# Altium schematic sheet KeyInput.SchDoc: Key Input
size A3; Author: eldar6776@hotmail.com; DrawnBy: Eldar Dedić; Organization: PROVEN d.o.o.; Address1: Adema Buće 102; Address2: 71000 Sarajevo; Address3: Federacija BiH; Address4: Bosna i Hercegovina; DocumentNumber: DE211213; Revision: 001; SheetNumber: 12; SheetTotal: 15; ProjectName: MIKSER SIROVINE
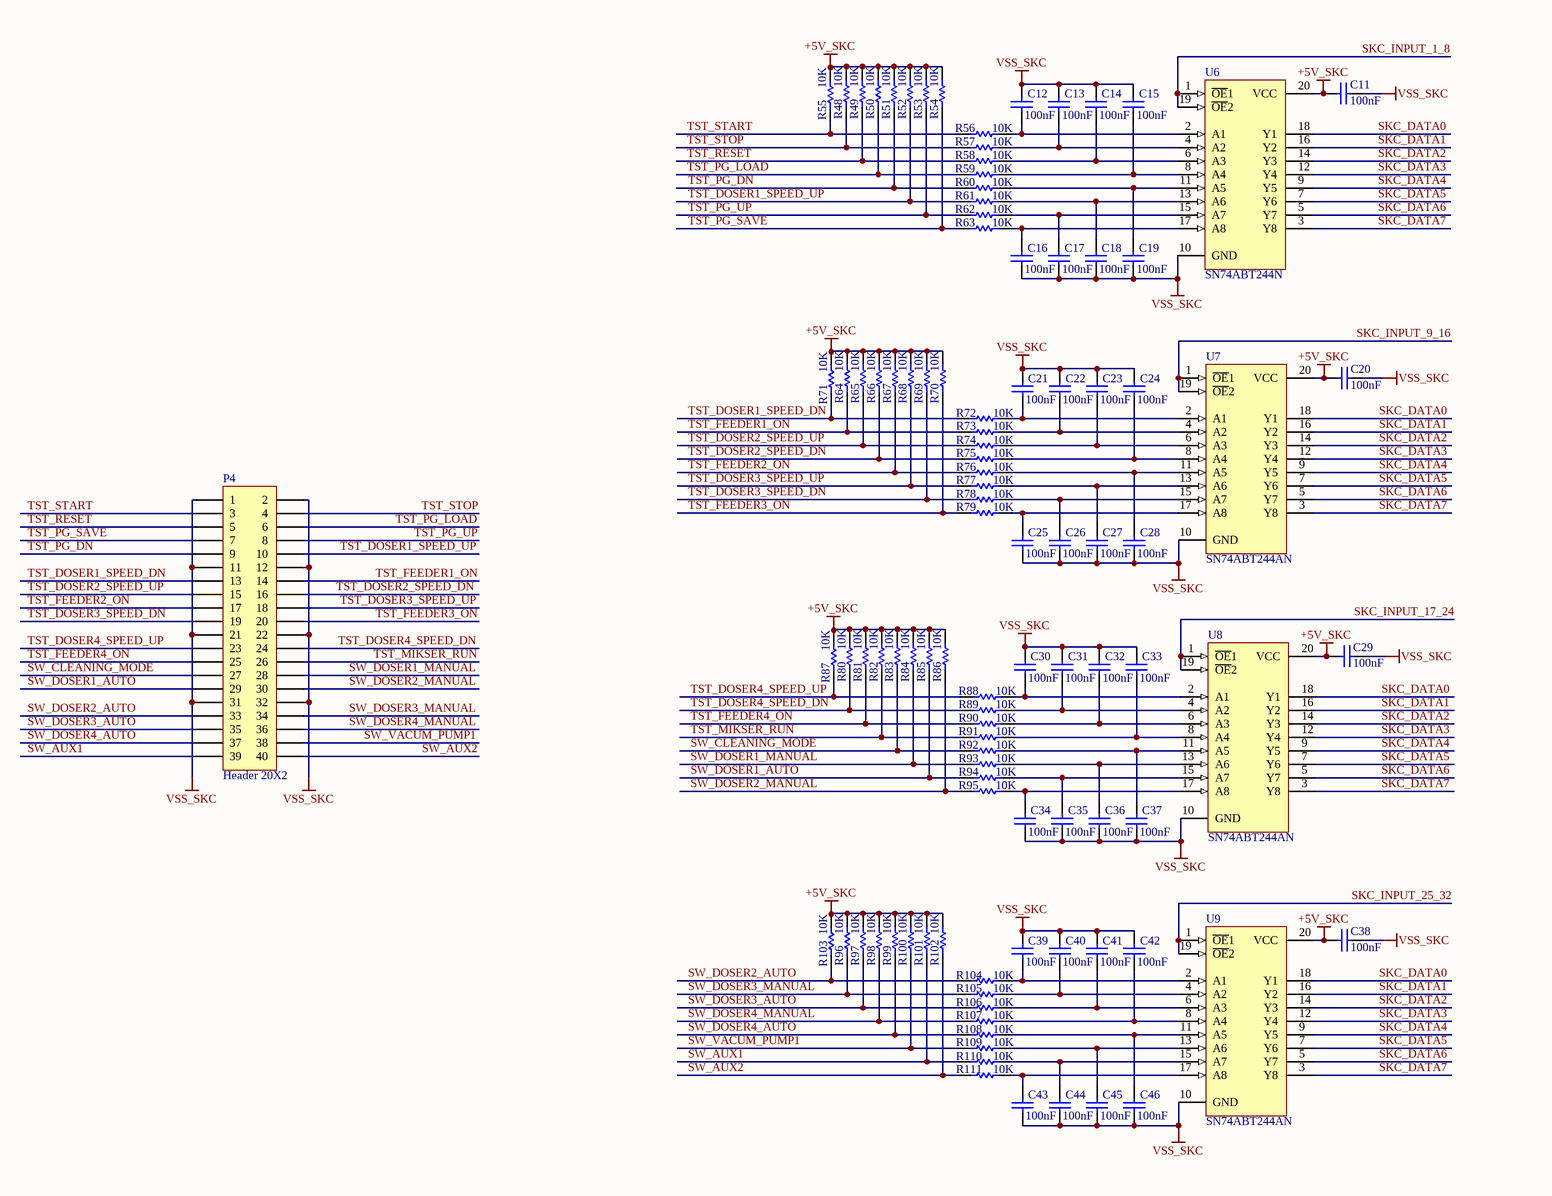
[diagram p0: KeyInput.SchDoc]

## Parts
C11  value 100nF  [1206]
C12  value 100nF  [1206]
C13  value 100nF  [1206]
C14  value 100nF  [1206]
C15  value 100nF  [1206]
C16  value 100nF  [1206]
C17  value 100nF  [1206]
C18  value 100nF  [1206]
C19  value 100nF  [1206]
C20  value 100nF  [1206]
C21  value 100nF  [1206]
C22  value 100nF  [1206]
C23  value 100nF  [1206]
C24  value 100nF  [1206]
C25  value 100nF  [1206]
C26  value 100nF  [1206]
C27  value 100nF  [1206]
C28  value 100nF  [1206]
C29  value 100nF  [1206]
C30  value 100nF  [1206]
C31  value 100nF  [1206]
C32  value 100nF  [1206]
C33  value 100nF  [1206]
C34  value 100nF  [1206]
C35  value 100nF  [1206]
C36  value 100nF  [1206]
C37  value 100nF  [1206]
C38  value 100nF  [1206]
C39  value 100nF  [1206]
C40  value 100nF  [1206]
C41  value 100nF  [1206]
C42  value 100nF  [1206]
C43  value 100nF  [1206]
C44  value 100nF  [1206]
C45  value 100nF  [1206]
C46  value 100nF  [1206]
P4  Header 20X2  [HDR2X20]
R48  10K  [ERA-0805]
R49  10K  [ERA-0805]
R50  10K  [ERA-0805]
R51  10K  [ERA-0805]
R52  10K  [ERA-0805]
R53  10K  [ERA-0805]
R54  10K  [ERA-0805]
R55  10K  [ERA-0805]
R56  10K  [ERA-0805]
R57  10K  [ERA-0805]
R58  10K  [ERA-0805]
R59  10K  [ERA-0805]
R60  10K  [ERA-0805]
R61  10K  [ERA-0805]
R62  10K  [ERA-0805]
R63  10K  [ERA-0805]
R64  10K  [ERA-0805]
R65  10K  [ERA-0805]
R66  10K  [ERA-0805]
R67  10K  [ERA-0805]
R68  10K  [ERA-0805]
R69  10K  [ERA-0805]
R70  10K  [ERA-0805]
R71  10K  [ERA-0805]
R72  10K  [ERA-0805]
R73  10K  [ERA-0805]
R74  10K  [ERA-0805]
R75  10K  [ERA-0805]
R76  10K  [ERA-0805]
R77  10K  [ERA-0805]
R78  10K  [ERA-0805]
R79  10K  [ERA-0805]
R80  10K  [ERA-0805]
R81  10K  [ERA-0805]
R82  10K  [ERA-0805]
R83  10K  [ERA-0805]
R84  10K  [ERA-0805]
R85  10K  [ERA-0805]
R86  10K  [ERA-0805]
R87  10K  [ERA-0805]
R88  10K  [ERA-0805]
R89  10K  [ERA-0805]
R90  10K  [ERA-0805]
R91  10K  [ERA-0805]
R92  10K  [ERA-0805]
R93  10K  [ERA-0805]
R94  10K  [ERA-0805]
R95  10K  [ERA-0805]
R96  10K  [ERA-0805]
R97  10K  [ERA-0805]
R98  10K  [ERA-0805]
R99  10K  [ERA-0805]
R100  10K  [ERA-0805]
R101  10K  [ERA-0805]
R102  10K  [ERA-0805]
R103  10K  [ERA-0805]
R104  10K  [ERA-0805]
R105  10K  [ERA-0805]
R106  10K  [ERA-0805]
R107  10K  [ERA-0805]
R108  10K  [ERA-0805]
R109  10K  [ERA-0805]
R110  10K  [ERA-0805]
R111  10K  [ERA-0805]
U6  SN74ABT244N  [N020]
U7  SN74ABT244AN  [N020]
U8  SN74ABT244AN  [N020]
U9  SN74ABT244AN  [N020]

## Nets
+5V_SKC: C11.1 C20.1 C29.1 C38.1 R48.2 R49.2 R50.2 R51.2 R52.2 R53.2 R54.2 R55.2 R64.2 R65.2 R66.2 R67.2 R68.2 R69.2 R70.2 R71.2 R80.2 R81.2 R82.2 R83.2 R84.2 R85.2 R86.2 R87.2 R96.2 R97.2 R98.2 R99.2 R100.2 R101.2 R102.2 R103.2 U6.20(VCC) U7.20(VCC) U8.20(VCC) U9.20(VCC)
VSS_SKC: C11.2 C12.2 C13.2 C14.2 C15.2 C16.1 C17.1 C18.1 C19.1 C20.2 C21.2 C22.2 C23.2 C24.2 C25.1 C26.1 C27.1 C28.1 C29.2 C30.2 C31.2 C32.2 C33.2 C34.1 C35.1 C36.1 C37.1 C38.2 C39.2 C40.2 C41.2 C42.2 C43.1 C44.1 C45.1 C46.1 P4.1 P4.2 P4.11 P4.12 P4.21 P4.22 P4.31 P4.32 U6.10(GND) U7.10(GND) U8.10(GND) U9.10(GND)
SKC_DATA0: U6.18(Y1) U7.18(Y1) U8.18(Y1) U9.18(Y1)
SKC_DATA1: U6.16(Y2) U7.16(Y2) U8.16(Y2) U9.16(Y2)
SKC_DATA2: U6.14(Y3) U7.14(Y3) U8.14(Y3) U9.14(Y3)
SKC_DATA3: U6.12(Y4) U7.12(Y4) U8.12(Y4) U9.12(Y4)
SKC_DATA4: U6.9(Y5) U7.9(Y5) U8.9(Y5) U9.9(Y5)
SKC_DATA5: U6.7(Y6) U7.7(Y6) U8.7(Y6) U9.7(Y6)
SKC_DATA6: U6.5(Y7) U7.5(Y7) U8.5(Y7) U9.5(Y7)
SKC_DATA7: U6.3(Y8) U7.3(Y8) U8.3(Y8) U9.3(Y8)
SKC_INPUT_1_8: U6.1(~{OE}1) U6.19(~{OE}2)
SKC_INPUT_9_16: U7.1(~{OE}1) U7.19(~{OE}2)
SKC_INPUT_17_24: U8.1(~{OE}1) U8.19(~{OE}2)
SKC_INPUT_25_32: U9.1(~{OE}1) U9.19(~{OE}2)
SW_AUX1: P4.39 R101.1 R110.1
SW_AUX2: P4.40 R102.1 R111.1
SW_CLEANING_MODE: P4.27 R83.1 R92.1
SW_DOSER1_AUTO: P4.29 R85.1 R94.1
SW_DOSER1_MANUAL: P4.28 R84.1 R93.1
SW_DOSER2_AUTO: P4.33 R103.1 R104.1
SW_DOSER2_MANUAL: P4.30 R86.1 R95.1
SW_DOSER3_AUTO: P4.35 R97.1 R106.1
SW_DOSER3_MANUAL: P4.34 R96.1 R105.1
SW_DOSER4_AUTO: P4.37 R99.1 R108.1
SW_DOSER4_MANUAL: P4.36 R98.1 R107.1
SW_VACUM_PUMP1: P4.38 R100.1 R109.1
TST_DOSER1_SPEED_DN: P4.13 R71.1 R72.1
TST_DOSER1_SPEED_UP: P4.10 R52.1 R61.1
TST_DOSER2_SPEED_DN: P4.16 R66.1 R75.1
TST_DOSER2_SPEED_UP: P4.15 R65.1 R74.1
TST_DOSER3_SPEED_DN: P4.19 R69.1 R78.1
TST_DOSER3_SPEED_UP: P4.18 R68.1 R77.1
TST_DOSER4_SPEED_DN: P4.24 R80.1 R89.1
TST_DOSER4_SPEED_UP: P4.23 R87.1 R88.1
TST_FEEDER1_ON: P4.14 R64.1 R73.1
TST_FEEDER2_ON: P4.17 R67.1 R76.1
TST_FEEDER3_ON: P4.20 R70.1 R79.1
TST_FEEDER4_ON: P4.25 R81.1 R90.1
TST_MIKSER_RUN: P4.26 R82.1 R91.1
TST_PG_DN: P4.9 R51.1 R60.1
TST_PG_LOAD: P4.6 R50.1 R59.1
TST_PG_SAVE: P4.7 R54.1 R63.1
TST_PG_UP: P4.8 R53.1 R62.1
TST_RESET: P4.5 R49.1 R58.1
TST_START: P4.3 R55.1 R56.1
TST_STOP: P4.4 R48.1 R57.1
NetC12_1: C12.1 R56.2 U6.2(A1)
NetC13_1: C13.1 R57.2 U6.4(A2)
NetC14_1: C14.1 R58.2 U6.6(A3)
NetC15_1: C15.1 R59.2 U6.8(A4)
NetC16_2: C16.2 R63.2 U6.17(A8)
NetC17_2: C17.2 R62.2 U6.15(A7)
NetC18_2: C18.2 R61.2 U6.13(A6)
NetC19_2: C19.2 R60.2 U6.11(A5)
NetC21_1: C21.1 R72.2 U7.2(A1)
NetC22_1: C22.1 R73.2 U7.4(A2)
NetC23_1: C23.1 R74.2 U7.6(A3)
NetC24_1: C24.1 R75.2 U7.8(A4)
NetC25_2: C25.2 R79.2 U7.17(A8)
NetC26_2: C26.2 R78.2 U7.15(A7)
NetC27_2: C27.2 R77.2 U7.13(A6)
NetC28_2: C28.2 R76.2 U7.11(A5)
NetC30_1: C30.1 R88.2 U8.2(A1)
NetC31_1: C31.1 R89.2 U8.4(A2)
NetC32_1: C32.1 R90.2 U8.6(A3)
NetC33_1: C33.1 R91.2 U8.8(A4)
NetC34_2: C34.2 R95.2 U8.17(A8)
NetC35_2: C35.2 R94.2 U8.15(A7)
NetC36_2: C36.2 R93.2 U8.13(A6)
NetC37_2: C37.2 R92.2 U8.11(A5)
NetC39_1: C39.1 R104.2 U9.2(A1)
NetC40_1: C40.1 R105.2 U9.4(A2)
NetC41_1: C41.1 R106.2 U9.6(A3)
NetC42_1: C42.1 R107.2 U9.8(A4)
NetC43_2: C43.2 R111.2 U9.17(A8)
NetC44_2: C44.2 R110.2 U9.15(A7)
NetC45_2: C45.2 R109.2 U9.13(A6)
NetC46_2: C46.2 R108.2 U9.11(A5)

## Notes on the sheet
- Title
- Size:
- Date:
- A3
- Number:
- Time:
- Revision:
- Sheet
- of
- File:

## Library data of the parts
C11-C46 = C1206: Ceramic Chip Capacitor - Standard; Published: 17-Jul-2002; LatestRevisionDate: 19-Mar-2004; LatestRevisionNote: Silkscreen size reduced.; DatasheetDocument: Mar-2001; PackageDocument: Mar-2001; PackageReference: 1206; Publisher: Altium Limited; Code_JEITA: 1206; Code_IPC: 3216 [1206]; ComponentLink1Description: Manufacturer Link; ComponentLink1URL: http://www.kemet.com/; ComponentLink2Description: Datasheet; ComponentLink2URL: http://www.kemet.com/kemet/web/homepage/kechome.nsf/vapubfilesname/F3102TA.pdf/$file/F3102TA.pdf
P4 = Header 20X2: Header, 20-Pin, Dual row; LatestRevisionDate: 17-Jul-2002; LatestRevisionNote: Re-released for DXP Platform.; Publisher: Altium Limited
R48-R111 = ERA6Y: Rectangular Thick Film Chip Resistor, 10 Ohm to 1M Ohm Range, 0.1% and 0.5% Tolerance, 0805 Size, 0.1 W; Note: If flow soldering, adjust pad width of PCB Footprint to 0.7 - 0.8 times the width of the resistor.; Published: 17-Dec-2003; LatestRevisionDate: 19-Mar-2004; LatestRevisionNote: Silkscreen size reduced.; PackageDocument: Mar-2003; PackageReference: ERA-0805; Publisher: Altium Limited; Code_IPC: 2012 [0805]; ComponentLink1Description: Manufacturer Link; ComponentLink1URL: http://www.panasonic.com/industrial/components/resistive_products.htm; ComponentLink2Description: Datasheet; ComponentLink2URL: http://www.panasonic.com/industrial/components/pdf/AOA0000CE8.pdf
U6 = SN74ABT244N: Octal Buffer/Driver with 3-State Outputs; ComponentAvailability: Obsolete; Published: 8-Jun-2000; LatestRevisionDate: 06-Jun-2005; LatestRevisionNote: Stylized 3D Model Added.; DatasheetVersion: Jul-1994; PackageVersion: Oct-1995; PackageReference: N020; Publisher: Altium Limited; PackageDescription: DIP; 20 Leads; Row Spacing 7.62 mm; Pitch 2.54 mm; ComponentLink1Description: Manufacturer Link; ComponentLink1URL: http://www.ti.com/; ComponentLink2Description: Discontinuation Notice; ComponentLink2URL: http://focus.ti.com/docs/prod/folders/print/sn74abt244.html
U7-U9 = SN74ABT244AN: Octal Buffer/Driver with 3-State Outputs; Published: 8-Jun-2000; LatestRevisionDate: 06-Jun-2005; LatestRevisionNote: Stylized 3D Model Added.; DatasheetVersion: Jan-1997; PackageVersion: Oct-1995; PackageReference: N020; Publisher: Altium Limited; PackageDescription: DIP; 20 Leads; Row Spacing 7.62 mm; Pitch 2.54 mm; ComponentLink1Description: Manufacturer Link; ComponentLink1URL: http://www.ti.com/; ComponentLink2Description: Datasheet; ComponentLink2URL: http://www-s.ti.com/sc/ds/sn74abt244a.pdf